# Altium schematic sheet Power.SchDoc
size A4
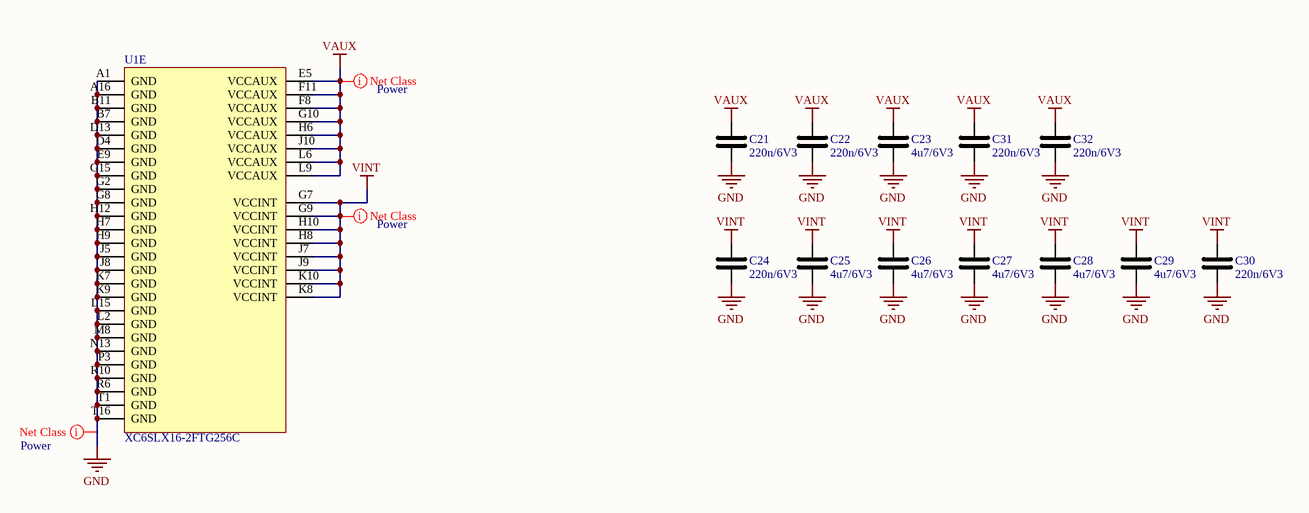
[diagram p0: Power.SchDoc]

## Parts
C21  220n/6V3  [C0402_N]
C22  220n/6V3  [C0402_N]
C23  4u7/6V3  [C0805_N]
C24  220n/6V3  [C0402_N]
C25  4u7/6V3  [C0805_N]
C26  4u7/6V3  [C0805_N]
C27  4u7/6V3  [C0805_N]
C28  4u7/6V3  [C0805_N]
C29  4u7/6V3  [C0805_N]
C30  220n/6V3  [C0402_N]
C31  220n/6V3  [C0402_N]
C32  220n/6V3  [C0402_N]
U1  XC6SLX16-2FTG256C  [Xilinx_FT256_L]  (part E of 5)

## Nets
GND: C21.1 C22.1 C23.1 C24.1 C25.1 C26.1 C27.1 C28.1 C29.1 C30.1 C31.1 C32.1 U1.A1(GND) U1.A16(GND) U1.B7(GND) U1.B11(GND) U1.D4(GND) U1.D13(GND) U1.E9(GND) U1.G2(GND) U1.G8(GND) U1.G15(GND) U1.H7(GND) U1.H9(GND) U1.H12(GND) U1.J5(GND) U1.J8(GND) U1.K7(GND) U1.K9(GND) U1.L2(GND) U1.L15(GND) U1.M8(GND) U1.N13(GND) U1.P3(GND) U1.R6(GND) U1.R10(GND) U1.T1(GND) U1.T16(GND)
VAUX: C21.2 C22.2 C23.2 C31.2 C32.2 U1.E5(VCCAUX) U1.F8(VCCAUX) U1.F11(VCCAUX) U1.G10(VCCAUX) U1.H6(VCCAUX) U1.J10(VCCAUX) U1.L6(VCCAUX) U1.L9(VCCAUX)
VINT: C24.2 C25.2 C26.2 C27.2 C28.2 C29.2 C30.2 U1.G7(VCCINT) U1.G9(VCCINT) U1.H8(VCCINT) U1.H10(VCCINT) U1.J7(VCCINT) U1.J9(VCCINT) U1.K8(VCCINT) U1.K10(VCCINT)

## Layout directives
net class Power: GND, VAUX, VINT

## Library data of the parts
C21-C32 = C